# Altium schematic sheet BMS_BALANCE.SchDoc
size B; Organization: Altium Limited; Address1: L3, 12a Rodborough Rd; Address2: Frenchs Forest; Address3: NSW; Address4: Australia 2086
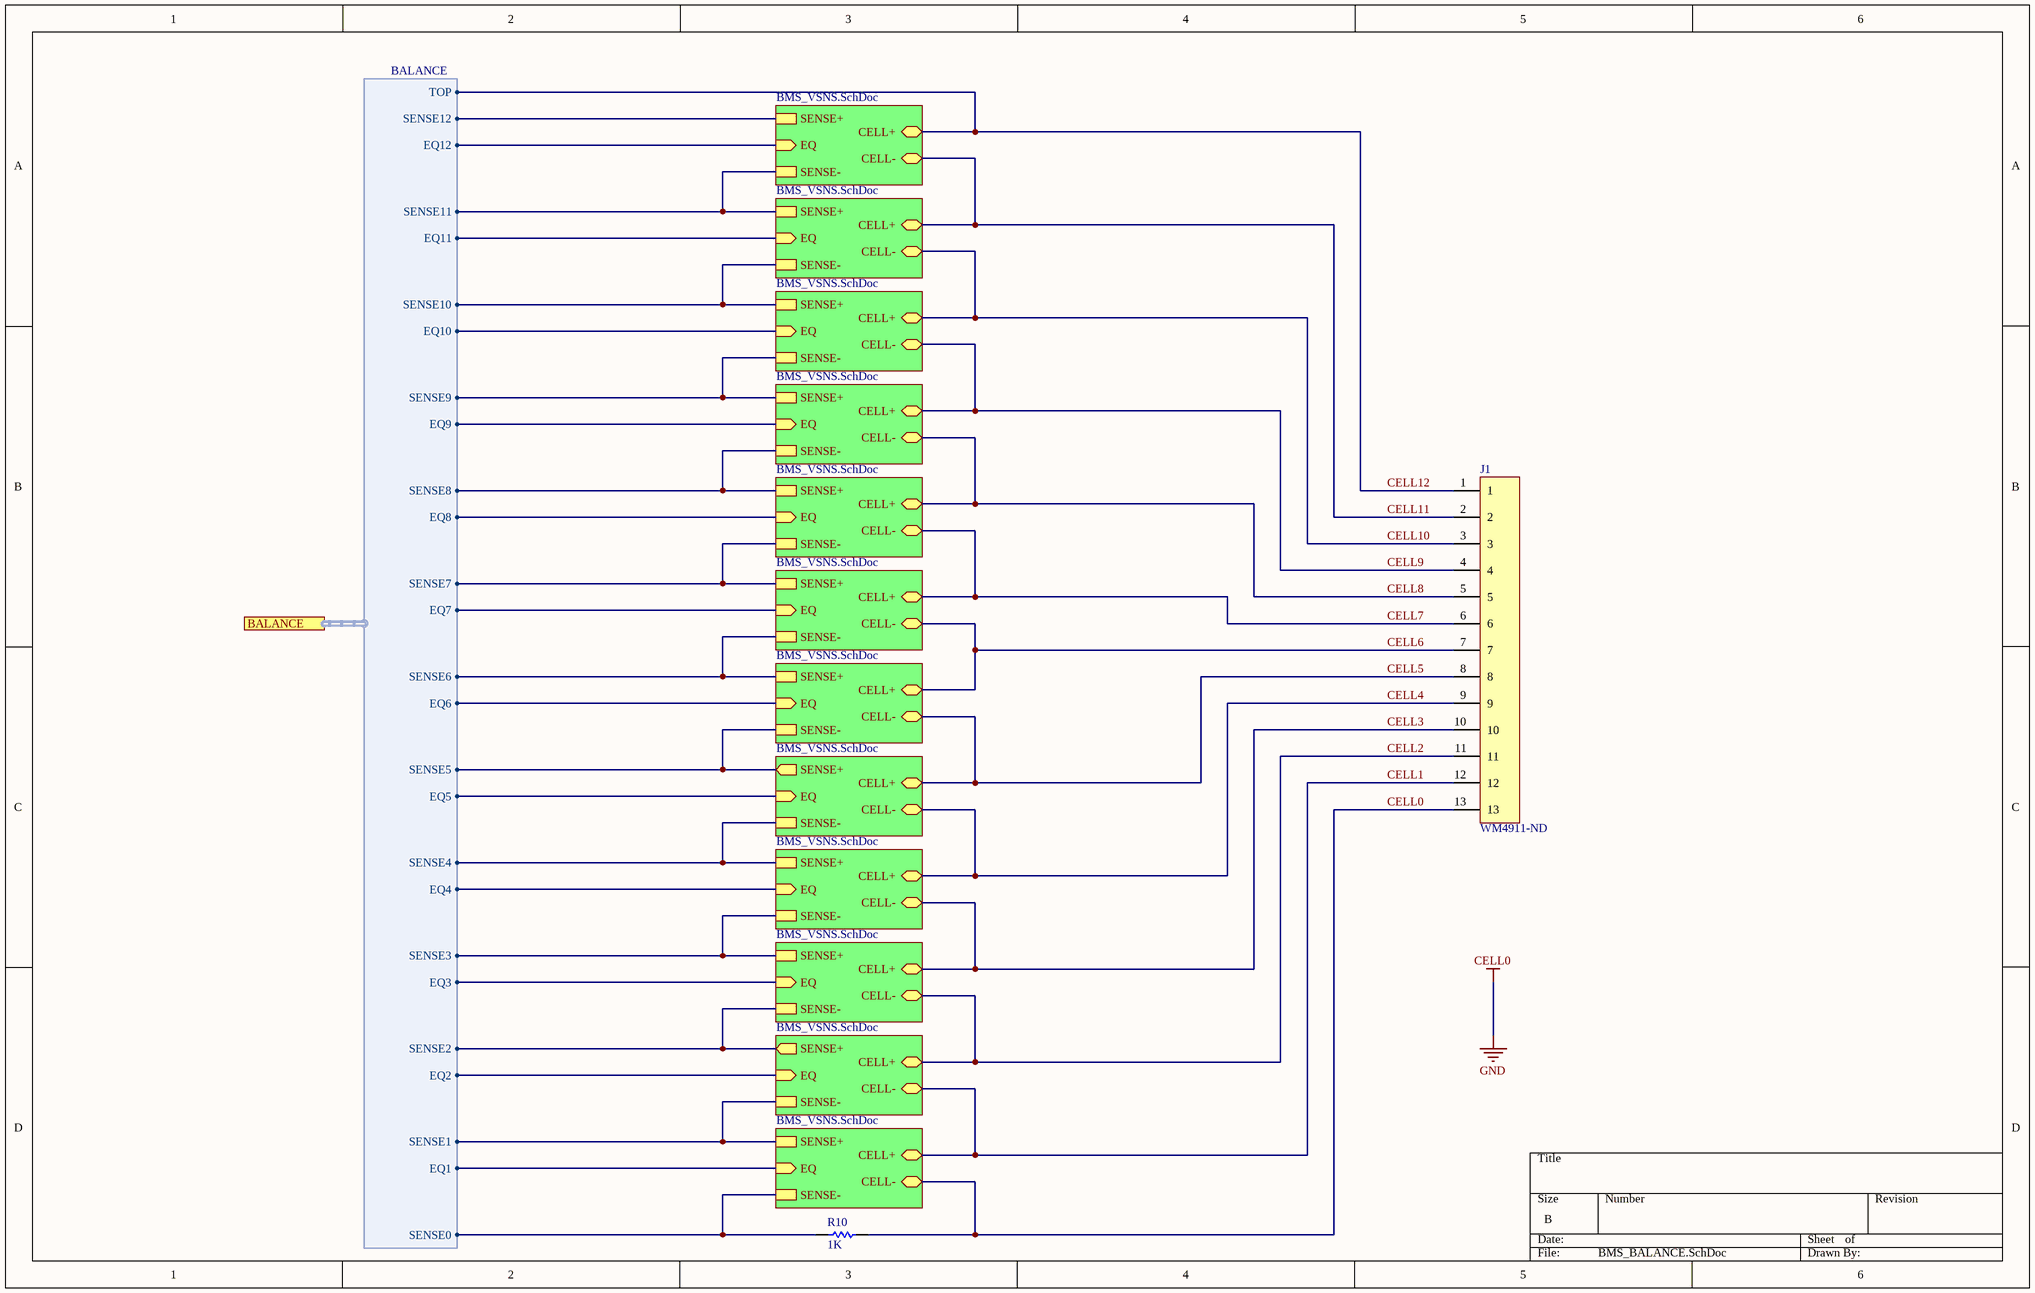
[diagram p0: BMS_BALANCE.SchDoc]

## Parts
J1  WM4911-ND  [13PIN]
R10  1K  [RES-0603]

## Sub-sheets
1 = BMS_VSNS.SchDoc: EQ (in), SENSE+, SENSE-, CELL+ (bidir), CELL- (bidir)
2 = BMS_VSNS.SchDoc: EQ (in), SENSE+ (out), SENSE-, CELL+ (bidir), CELL- (bidir)
3 = BMS_VSNS.SchDoc: EQ (in), SENSE+, SENSE-, CELL+ (bidir), CELL- (bidir)
4 = BMS_VSNS.SchDoc: EQ (in), SENSE+, SENSE-, CELL+ (bidir), CELL- (bidir)
5 = BMS_VSNS.SchDoc: EQ (in), SENSE+ (out), SENSE-, CELL+ (bidir), CELL- (bidir)
6 = BMS_VSNS.SchDoc: EQ (in), SENSE+, SENSE-, CELL+ (bidir), CELL- (bidir)
7 = BMS_VSNS.SchDoc: EQ (in), SENSE+, SENSE-, CELL+ (bidir), CELL- (bidir)
8 = BMS_VSNS.SchDoc: EQ (in), SENSE+, SENSE-, CELL+ (bidir), CELL- (bidir)
9 = BMS_VSNS.SchDoc: EQ (in), SENSE+, SENSE-, CELL+ (bidir), CELL- (bidir)
10 = BMS_VSNS.SchDoc: EQ (in), SENSE+, SENSE-, CELL+ (bidir), CELL- (bidir)
11 = BMS_VSNS.SchDoc: EQ (in), SENSE+, SENSE-, CELL+ (bidir), CELL- (bidir)
12 = BMS_VSNS.SchDoc: EQ (in), SENSE+, SENSE-, CELL+ (bidir), CELL- (bidir)

## Ports
BALANCE (harness BALANCE)

## Harnesses
BALANCE: EQ6, SENSE6, EQ7, SENSE7, EQ8, SENSE8, EQ9, SENSE9, SENSE5, EQ5, SENSE4, EQ4, SENSE3, EQ3, SENSE2, EQ2, SENSE1, EQ1, SENSE0, SENSE10, EQ10, TOP, EQ11, SENSE11, SENSE12, EQ12

## Nets
CELL0: J1.13 R10.2 ; sheet 1/CELL-  [also labelled GND]
CELL1: J1.12 ; sheet 2/CELL-, sheet 1/CELL+
CELL2: J1.11 ; sheet 3/CELL-, sheet 2/CELL+
CELL3: J1.10 ; sheet 4/CELL-, sheet 3/CELL+
CELL4: J1.9 ; sheet 5/CELL-, sheet 4/CELL+
CELL5: J1.8 ; sheet 6/CELL-, sheet 5/CELL+
CELL6: J1.7 ; sheet 7/CELL-, sheet 6/CELL+
CELL7: J1.6 ; sheet 8/CELL-, sheet 7/CELL+
CELL8: J1.5 ; sheet 8/CELL+, sheet 9/CELL-
CELL9: J1.4 ; sheet 9/CELL+, sheet 10/CELL-
CELL10: J1.3 ; sheet 11/CELL-, sheet 10/CELL+
CELL11: J1.2 ; sheet 11/CELL+, sheet 12/CELL-
CELL12: J1.1 ; sheet 12/CELL+, port BALANCE.TOP
NetR10_1: R10.1 ; sheet 1/SENSE-, port BALANCE.SENSE0
(unnamed): sheet 8/EQ, port BALANCE.EQ8
(unnamed): sheet 8/SENSE+, sheet 9/SENSE-, port BALANCE.SENSE8
(unnamed): sheet 8/SENSE-, sheet 7/SENSE+, port BALANCE.SENSE7
(unnamed): sheet 7/EQ, port BALANCE.EQ7
(unnamed): sheet 7/SENSE-, sheet 6/SENSE+, port BALANCE.SENSE6
(unnamed): sheet 6/EQ, port BALANCE.EQ6
(unnamed): sheet 6/SENSE-, sheet 5/SENSE+, port BALANCE.SENSE5
(unnamed): sheet 5/EQ, port BALANCE.EQ5
(unnamed): sheet 5/SENSE-, sheet 4/SENSE+, port BALANCE.SENSE4
(unnamed): sheet 4/EQ, port BALANCE.EQ4
(unnamed): sheet 4/SENSE-, sheet 3/SENSE+, port BALANCE.SENSE3
(unnamed): sheet 3/EQ, port BALANCE.EQ3
(unnamed): sheet 3/SENSE-, sheet 2/SENSE+, port BALANCE.SENSE2
(unnamed): sheet 2/EQ, port BALANCE.EQ2
(unnamed): sheet 2/SENSE-, sheet 1/SENSE+, port BALANCE.SENSE1
(unnamed): sheet 1/EQ, port BALANCE.EQ1
(unnamed): sheet 9/EQ, port BALANCE.EQ9
(unnamed): sheet 9/SENSE+, sheet 10/SENSE-, port BALANCE.SENSE9
(unnamed): sheet 11/EQ, port BALANCE.EQ11
(unnamed): sheet 11/SENSE+, sheet 12/SENSE-, port BALANCE.SENSE11
(unnamed): sheet 11/SENSE-, sheet 10/SENSE+, port BALANCE.SENSE10
(unnamed): sheet 10/EQ, port BALANCE.EQ10
(unnamed): sheet 12/EQ, port BALANCE.EQ12
(unnamed): sheet 12/SENSE+, port BALANCE.SENSE12

## Notes on the sheet
- Title
- Size:
- Date:
- Tabloid
- Number:
- Time:
- Revision:
- Sheet
- of
- File:

## Library data of the parts
J1 = 13PIN: CONN HEADER R/A 13POS 2.54MM; Manufacturer: Molex; Manufacturer Part Number: 0705530012; Contact Resistance: 30mR; Number of Positions: 13; Gender: Male; Connector Type: Male Pin; Pitch: 0.1inch; Supplier 1: Digi-Key; Stock 1: 22; Pricing 1: 1=6.09, 10=5.355, 100=4.2597, 1000=3.52944 (USD); Mount: Through Hole; Contact Material: Bronze; Contact Plating: Gold; Housing Color: Black; Housing Material: Polyester; Color: Black; Min Operating Temperature: -40°C; Max Operating Temperature: 105°C; Package Quantity: 1; Packaging: Rail/Tube; Number of Rows: 1; Termination: Solder; Orientation: Right Angle; Length: 35.57mm; Contact Mating Length: 0.24inch; Depth: 13.59mm; Supplier Part Number 1: WM4911-ND
R10 = 0603-1KR: RES SMD 1K OHM 1% 1/10W 0603; Manufacturer: Vishay Dale; Manufacturer Part Number: CRCW06031K00FKEA; Resistance: 1kR; Power Rating: 100mW; Voltage Rating: 75V; Temperature Coefficient: 100ppm/°C; Supplier 1: Digi-Key; Stock 1: 671453; Pricing 1: 1=0.1, 10=0.034, 100=0.0139, 1000=0.00623, 2500=0.0054 (USD); Mount: Surface Mount; Case/Package: 0603; Number of Pins: 2; Weight: 7.1E-05oz; Case Code (Metric): 1608; Case Code (Imperial): 0603; Contact Plating: Tin; Min Operating Temperature: -55°C; Max Operating Temperature: 155°C; Composition: Thick Film; Tolerance: 1%; Packaging: Tape and Reel; Package Quantity: 10; Number of Terminations: 2; Termination: SMD/SMT; Military Standard: Not; Max Power Dissipation: 100mW; Voltage Rating (DC): 75V; Features: Automotive AEC-Q200; Length: 1.55mm; Height: 0.45mm; Width: 0.033inch; Depth: 0.85mm; Radiation Hardening: No; REACH SVHC: Unknown; Lead Free: Lead Free; ComponentLink1URL: http://www.vishay.com/docs/20035/dcrcwe3.pdf?src-supplier=Digi-Key; ComponentLink1Description: http://www.vishay.com/docs/20035/dcrcwe3.pdf?src-supplier=Digi-Key; ComponentLink2URL: http://uk.rs-online.com/webdocs/0d98/0900766b80d98afc.pdf?src-supplier=RSComponents; ComponentLink2Description: http://uk.rs-online.com/webdocs/0d98/0900766b80d98afc.pdf?src-supplier=RSComponents; ComponentLink3URL: http://www.vishay.com/docs/20035/dcrcwe3.pdf?src-supplier=Avnet; ComponentLink3Description: http://www.vishay.com/docs/20035/dcrcwe3.pdf?src-supplier=Avnet; ComponentLink4URL: http://www.vishay.com/docs/20035/dcrcwe3.pdf?src-supplier=Avnet+Asia; ComponentLink4Description: http://www.vishay.com/docs/20035/dcrcwe3.pdf?src-supplier=Avnet+Asia; ComponentLink5URL: http://www.farnell.com/datasheets/2310790.pdf?src-supplier=Element14; ComponentLink5Description: http://www.farnell.com/datasheets/2310790.pdf?src-supplier=Element14; ComponentLink6URL: https://www.distrelec.biz/Web/Downloads/a_/en/flD-CRCW-e3_data_en.pdf?mime=application%2Fpdf&src-supplier=Distrelec; ComponentLink6Description: https://www.distrelec.biz/Web/Downloads/a_/en/flD-CRCW-e3_data_en.pdf?mime=application%2Fpdf&src-supplier=Distrelec; ComponentLink7URL: http://www.vishay.com/docs/20035/dcrcwe3.pdf?src-supplier=Future+Electronics; ComponentLink7Description: http://www.vishay.com/docs/20035/dcrcwe3.pdf?src-supplier=Future+Electronics; ComponentLink8URL: http://www.vishay.com/docs/20035/dcrcwe3.pdf?src-supplier=Avnet+Europe; ComponentLink8Description: http://www.vishay.com/docs/20035/dcrcwe3.pdf?src-supplier=Avnet+Europe; Supplier Part Number 1: 541-1.00KHCT-ND